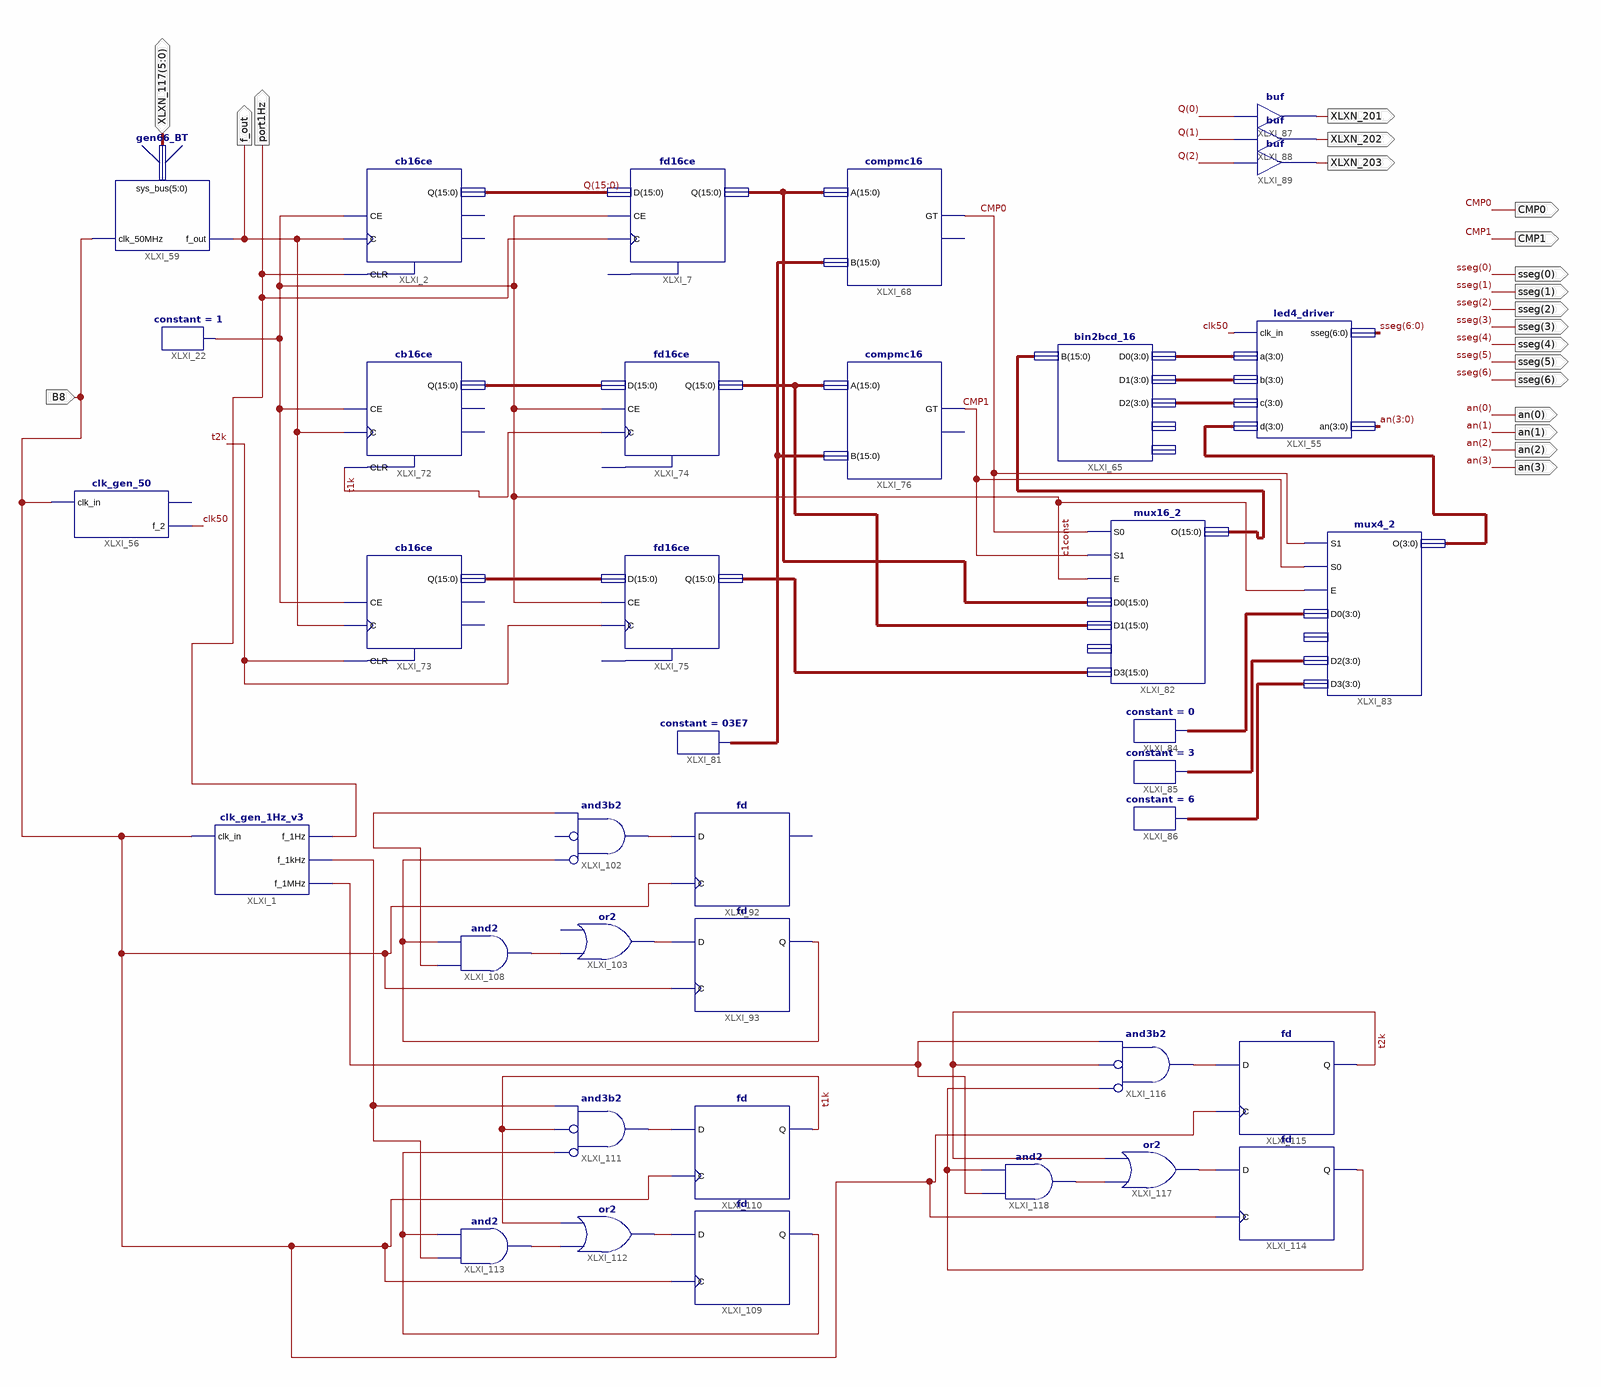
[diagram p0: schematic sheet 1]
// Xilinx ISE schematic czestotliwosci.sch (spartan3e) as structural Verilog: 38 symbols, 20 ports
module czestotliwosci (
  input  B8,
  inout  [5:0] XLXN_117,
  output port1Hz,
  output [6:0] sseg,
  output [3:0] an,
  output f_out,
  output CMP1,
  output CMP0,
  output XLXN_201,
  output XLXN_202,
  output XLXN_203
);

  wire c1const, clk50, t1k, t2k, XLXN_207, XLXN_208, XLXN_214, XLXN_220, XLXN_221, XLXN_222, XLXN_223,
       XLXN_227, XLXN_228, XLXN_229, XLXN_231, XLXN_237, XLXN_238, XLXN_239, XLXN_241;
  wire [3:0] XLXN_98, XLXN_99, XLXN_132, XLXN_193, XLXN_194, XLXN_196, XLXN_254;
  wire [15:0] Q, XLXN_154, XLXN_157, XLXN_174, XLXN_175, XLXN_176, XLXN_244, XLXN_246;

  cb16ce XLXI_2 (.C(f_out), .CE(c1const), .CLR(port1Hz), .Q(Q));  // open: CEO, TC
  constant #(.CValue("1")) XLXI_22 (.O(c1const));
  fd16ce XLXI_7 (.C(port1Hz), .CE(c1const), .D(Q), .Q(XLXN_246));  // open: CLR
  led4_driver XLXI_55 (.clk_in(clk50), .a(XLXN_132), .b(XLXN_98), .c(XLXN_99), .d(XLXN_193), .sseg(sseg), .an(an));
  clk_gen_50 XLXI_56 (.clk_in(B8), .f_2(clk50));  // open: f_1
  gen66_BT #(.pmodName("JC")) XLXI_59 (.clk_50MHz(B8), .sys_bus(XLXN_117), .f_out(f_out));
  bin2bcd_16 XLXI_65 (.B(XLXN_244), .D2(XLXN_99), .D1(XLXN_98), .D0(XLXN_132));  // open: D3, D4
  compmc16 XLXI_68 (.A(XLXN_246), .B(XLXN_176), .GT(CMP0));  // open: LT
  cb16ce XLXI_72 (.C(f_out), .CE(c1const), .CLR(t1k), .Q(XLXN_154));  // open: CEO, TC
  cb16ce XLXI_73 (.C(f_out), .CE(c1const), .CLR(t2k), .Q(XLXN_157));  // open: CEO, TC
  fd16ce XLXI_74 (.C(t1k), .CE(c1const), .D(XLXN_154), .Q(XLXN_174));  // open: CLR
  fd16ce XLXI_75 (.C(t2k), .CE(c1const), .D(XLXN_157), .Q(XLXN_175));  // open: CLR
  compmc16 XLXI_76 (.A(XLXN_174), .B(XLXN_176), .GT(CMP1));  // open: LT
  constant #(.CValue("03E7")) XLXI_81 (.O(XLXN_176));
  mux16_2 XLXI_82 (
    .D0(XLXN_246), .D1(XLXN_174), .D3(XLXN_175), .O(XLXN_244), .S1(CMP1), .E(c1const), .S0(CMP0));  // open: D2
  mux4_2 XLXI_83 (
    .S1(CMP0), .S0(CMP1), .E(c1const), .D0(XLXN_194), .D2(XLXN_254), .D3(XLXN_196), .O(XLXN_193));  // open: D1
  constant #(.CValue("0")) XLXI_84 (.O(XLXN_194));
  buf XLXI_87 (XLXN_201, Q[0]);
  buf XLXI_88 (XLXN_202, Q[1]);
  buf XLXI_89 (XLXN_203, Q[2]);
  clk_gen_1Hz_v3 XLXI_1 (.clk_in(B8), .f_1Hz(port1Hz), .f_1kHz(XLXN_207), .f_1MHz(XLXN_208));
  fd XLXI_93 (.C(B8), .D(XLXN_220), .Q(XLXN_222));
  fd XLXI_92 (.C(B8), .D(XLXN_221));  // open: Q
  and XLXI_102 (XLXN_221, ~XLXN_222, XLXN_223);  // and3b2 open: I1
  buf XLXI_103 (XLXN_220, XLXN_214);  // or2 open: I1
  and XLXI_108 (XLXN_214, XLXN_223, XLXN_222);
  fd XLXI_109 (.C(B8), .D(XLXN_228), .Q(XLXN_231));
  fd XLXI_110 (.C(B8), .D(XLXN_229), .Q(t1k));
  and XLXI_111 (XLXN_229, ~XLXN_231, ~t1k, XLXN_207);  // and3b2
  or XLXI_112 (XLXN_228, XLXN_227, t1k);
  and XLXI_113 (XLXN_227, XLXN_207, XLXN_231);
  fd XLXI_114 (.C(B8), .D(XLXN_238), .Q(XLXN_241));
  fd XLXI_115 (.C(B8), .D(XLXN_239), .Q(t2k));
  and XLXI_116 (XLXN_239, ~XLXN_241, ~t2k, XLXN_208);  // and3b2
  or XLXI_117 (XLXN_238, XLXN_237, t2k);
  and XLXI_118 (XLXN_237, XLXN_208, XLXN_241);
  constant #(.CValue("6")) XLXI_86 (.O(XLXN_196));
  constant #(.CValue("3")) XLXI_85 (.O(XLXN_254));

  // Notes on the sheet:
  //   LOC on signal port1Hz = R4
  //   LOC on signal B8 = B8
  //   LOC on signal sseg(0) = L18
  //   LOC on signal sseg(1) = F18
  //   LOC on signal sseg(2) = D17
  //   LOC on signal sseg(3) = D16
  //   LOC on signal sseg(4) = G14
  //   LOC on signal sseg(5) = J17
  //   LOC on signal sseg(6) = H14
  //   LOC on signal an(0) = F17
  //   LOC on signal an(1) = H17
  //   LOC on signal an(2) = C18
  //   LOC on signal an(3) = F15
  //   LOC on signal f_out = F4
  //   LOC on signal CMP1 = J15
  //   LOC on signal CMP0 = J14
  //   LOC on signal XLXN_201 = K15
  //   LOC on signal XLXN_202 = K14
  //   LOC on signal XLXN_203 = E17
  //   LOC on signal c1const = R4
  //   LOC on signal XLXN_226 = B8
  //   LOC on signal t2k = R4
  //   LOC on signal XLXN_236 = B8
endmodule
